# EAGLE design main (EAGLE 7.2.0)
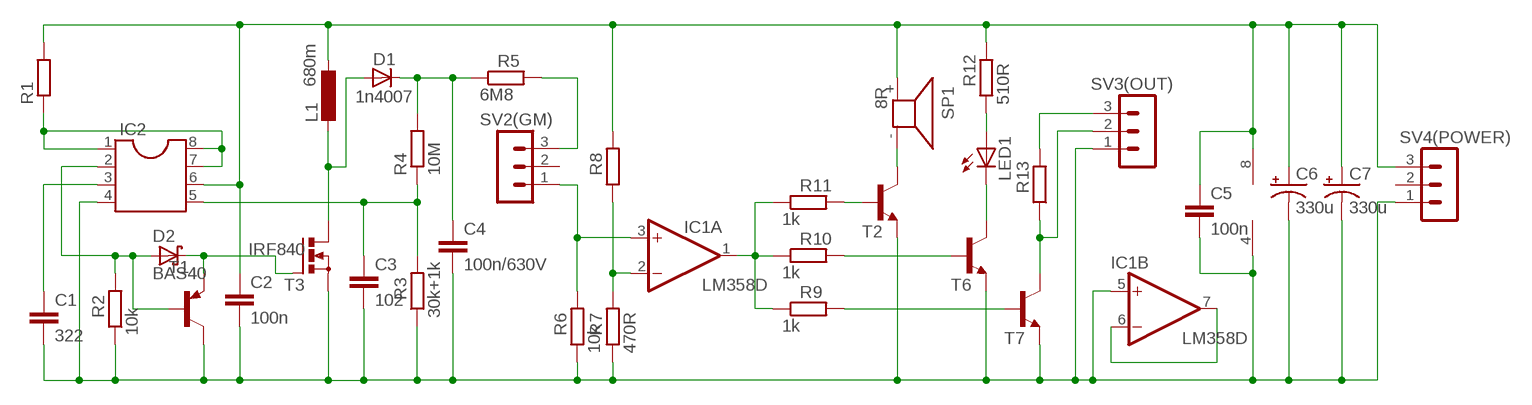
[diagram p0: schematic, sheet 1]

## Parts
C1  322  C-EU050-025X075  [C050-025X075]
C2  100n  C-EUC3216  [C3216]
C3  102  C-EU050-025X075  [C050-025X075]
C4  100n/630V  C-EU102-064X133  [C102-064X133]
C5  100n  C-EUC3216  [C3216]
C6  330u  CPOL-USA/3216-18W  [A/3216-18W]
C7  330u  CPOL-USA/3216-18W  [A/3216-18W]
D1  1n4007  1N4004  [DO41-10]
D2  BAS40  [SOT23]
IC1  LM358D  [SO08]
IC2  DIL8  [DIL08]
L1  680m  L-EU0207/5V  [0207/5V]
LED1  LEDSFH482  [SFH482]
R1  R-EU_0207/5V  [0207/5V]
R2  10k  R-EU_0207/5V  [0207/5V]
R3  30k+1k  R-EU_0207/5V  [0207/5V]
R4  10M  R-EU_0207/5V  [0207/5V]
R5  6M8  R-EU_0207/12  [0207/12]
R6  10k  R-EU_0207/5V  [0207/5V]
R7  470R  R-EU_0207/5V  [0207/5V]
R8  R-EU_0207/5V  [0207/5V]
R9  1k  R-EU_M1206  [M1206]
R10  1k  R-EU_M1206  [M1206]
R11  1k  R-EU_M1206  [M1206]
R12  510R  R-EU_M1206  [M1206]
R13  R-EU_M1206  [M1206]
SP1  8R  KSS1201  [KSS1201]
SV2(GM)  MA03-1  [MA03-1]
SV3(OUT)  MA03-1  [MA03-1]
SV4(POWER)  MA03-1  [MA03-1]
T1  BC807-40-PNP-SOT23-BEC  [SOT23-BEC]
T2  BC848ALT1SMD  [SOT23]
T3  IRF840  BUZ11BV  [TO220BV]
T6  BC848ALT1SMD  [SOT23]
T7  BC848ALT1SMD  [SOT23]

## Nets
N$1: R9.2 T7.1(B)
N$2: R10.2 T6.1(B)
N$3: LED1.K(C) T6.3(C)
N$4: R13.1 SV3(OUT).2 T7.3(C)
N$5: C1.1 IC2.3
N$6: LED1.A R12.1
N$8: IC1.1(A:OUT) R9.1 R10.1 R11.1
N$9: SP1.- T2.3(C)
N$10: R11.2 T2.1(B)
N$11: IC2.1 IC2.7 IC2.8 R1.1
N$12 [hv]: C4.1 D1.C R4.2 R5.1
N$13: C3.1 IC2.5 R3.2 R4.1
N$14: D2.1(A) IC2.2 R2.2 T1.B
N$15 [hv]: D1.A L1.2 T3.D
N$16: D2.3(C) T1.E T3.G
N$17: IC1.3(A:+IN) R6.2 SV2(GM).1
N$19: IC1.2(A:-IN) R7.2 R8.1
N$20 [hv]: R5.2 SV2(GM).3
N$21: R13.2 SV3(OUT).3
N$22: IC1.6(B:-IN) IC1.7(B:OUT)
V+: C2.1 C5.1 C6.+ C7.+ IC1.8(P:V+) IC2.6 L1.1 R1.2 R8.2 R12.2 SP1.+ SV4(POWER).3
V-: C1.2 C2.2 C3.2 C4.2 C5.2 C6.- C7.- IC1.4(P:V-) IC1.5(B:+IN) IC2.4 R2.1 R3.1 R6.1 R7.1 SV3(OUT).1 SV4(POWER).1 T1.C T2.2(E) T3.S T6.2(E) T7.2(E)
Unconnected: SV2(GM).2 SV4(POWER).2

## Library data of the parts
C1-C5 = resistor:C-EU: CAPACITOR, European symbol
C6 C7 = resistor:CPOL-US: POLARIZED CAPACITOR, American symbol
D1 = diode:1N4004: DIODE general purpose rectifier, 1 A
D2 = diode:BAS40: Silicon Schottky Diodes General-purpose diode for high-speed switching
IC1 = linear:LM358: OP AMP also LM158; LM258; LM2904 Source: http://cache.national.com/ds/LM/LM158.pdf
IC2 = ic-package:DIL8: Dual In Line / Socket
L1 = resistor:L-EU: INDUCTOR, European symbol
LED1 = led:LED: LED OSRAM: - CHIPLED LG R971, LG N971, LY N971, LG Q971, LY Q971, LO R971, LY R971 LH N974, LH R974 LS Q976, LO Q976, LY Q976 LO Q996 - Hyper CHIPLED LW Q18S LB Q993, LB Q99A, LB R99A - SideLED LS A670, LO A670, LY A670, LG A670, LP A670 LB A673, LV A673, LT A673, LW A673 LH A674 LY A675 LS A676, LA A676, LO A676, LY A676, LW A676 LS A679, LY A679, LG A679 - Hyper Micro SIDELED® LS Y876, LA Y876, LO Y876, LY Y876 LT Y87S - SmartLED LW L88C, LW L88S LB L89C, LB L89S, LG L890 LS L89K, LO L89K, LY L89K LS L896, LA L896, LO L896, LY L896 - TOPLED LS T670, LO T670, LY T670, LG T670, LP T670 LSG T670, LSP T670, LSY T670, LOP T670, LYG T670 LG T671, LOG T671, LSG T671 LB T673, LV T673, LT T673, LW T673 LH T674 LS T676, LA T676, LO T676, LY T676, LB T676, LH T676, LSB T676, LW T676 LB T67C, LV T67C, LT T67C, LS T67K, LO T67K, LY T67K, LW E67C LS E67B, LA E67B, LO E67B, LY E67B, LB E67C, LV E67C, LT E67C LW T67C LS T679, LY T679, LG T679 LS T770, LO T770, LY T770, LG T770, LP T770 LB T773, LV T773, LT T773, LW T773 LH T774 LS E675, LA E675, LY E675, LS T675 LS T776, LA T776, LO T776, LY T776, LB T776 LHGB T686 LT T68C, LB T68C - Hyper Mini TOPLED® LB M676 - Mini TOPLED Santana® LG M470 LS M47K, LO M47K, LY M47K Source: http://www.osram.convergy.de LUXEON: - LUMILED® LXK2-PW12-R00, LXK2-PW12-S00, LXK2-PW14-U00, LXK2-PW14-V00 LXK2-PM12-R00, LXK2-PM12-S00, LXK2-PM14-U00 LXK2-PE12-Q00, LXK2-PE12-R00, LXK2-PE12-S00, LXK2-PE14-T00, LXK2-PE14-U00 LXK2-PB12-K00, LXK2-PB12-L00, LXK2-PB12-M00, LXK2-PB14-N00, LXK2-PB14-P00, LXK2-PB14-Q00 LXK2-PR12-L00, LXK2-PR12-M00, LXK2-PR14-Q00, LXK2-PR14-R00 LXK2-PD12-Q00, LXK2-PD12-R00, LXK2-PD12-S00 LXK2-PH12-R00, LXK2-PH12-S00 LXK2-PL12-P00, LXK2-PL12-Q00, LXK2-PL12-R00 Source: www.luxeon.com KINGBRIGHT: KA-3528ASYC Source: www.kingbright.com
R1-R13 = resistor:R-EU_: RESISTOR, European symbol
SP1 = buzzer:KSS1201: SPEAKER Source: Schukat; OC_FARNELL: unknown; OC_NEWARK: unknown
SV2(GM) SV3(OUT) SV4(POWER) = con-lstb:MA03-1: PIN HEADER; OC_FARNELL: unknown; OC_NEWARK: unknown
T1 = transistor:*-PNP-: PNP Transistror
T2 T6 T7 = transistor-npn:BC848*: NPN Transistor
T3 = transistor-power:BUZ11: N-CHANNEL MOS FET

## Net classes
1 hv: clearance 0.584 mm

## Board
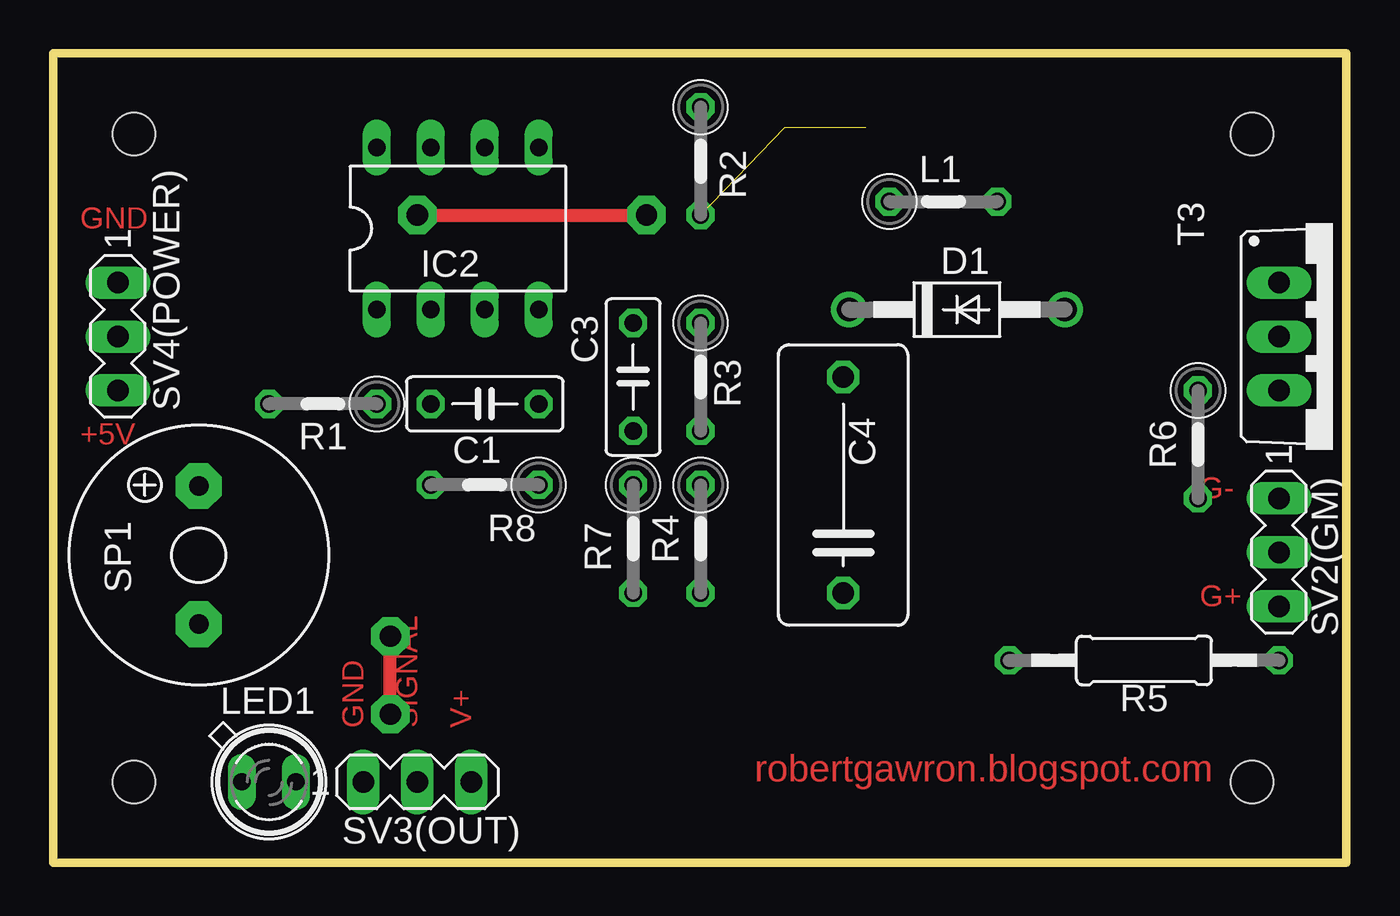
[diagram p1: board, top side]
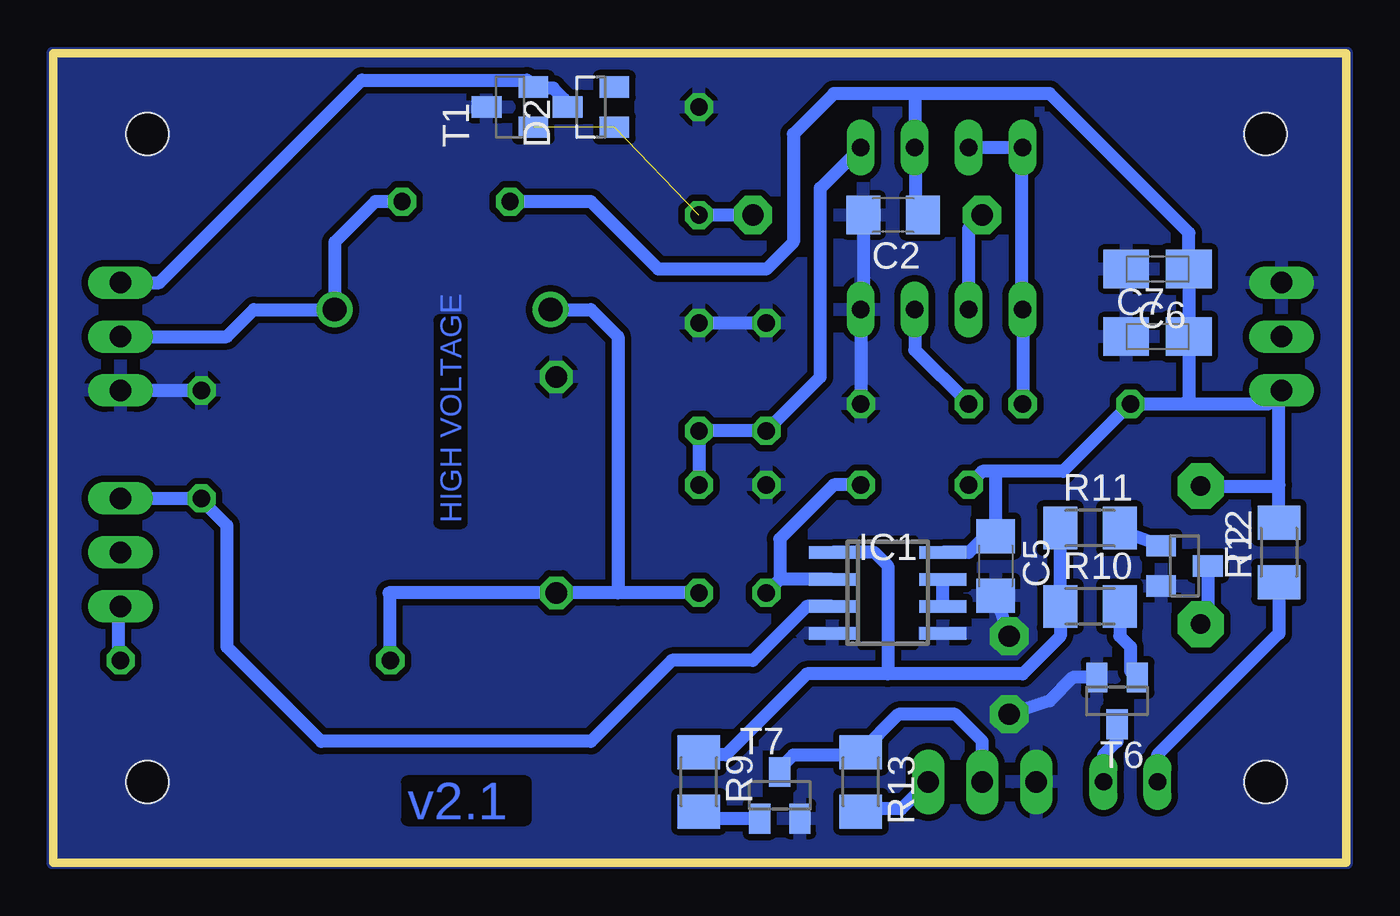
[diagram p2: board, bottom side, seen from below]

Size 60.88 x 38.1 mm. Coordinates in mm from the lower left corner, seen from the top.
Outline: 0,38.1 0,0 60.88,0 60.88,38.1 0,38.1
Copper layers (1*16): Top 0.035mm / dielectric 1.5mm / Bottom 0.035mm
Design rules "default *": minimum track width 10mil, minimum drill 24mil, track to track 12mil, track to pad 12mil, pad to pad 8mil, via to via 8mil, smd to smd 8mil, copper to edge 0mil, drill to drill 8mil, minimum pad ring 10mil, minimum via ring 8mil, stop-mask expansion 4mil, vias tented up to drill 0mil, thermal gap 10mil
Holes 2 mm at 3.81,3.81 3.81,34.29 56.43,34.29 56.43,3.81
bRestrict: area 20.3,10.2 to 22.9,15.2

### Footprints (pad centres in the part's own frame; a part is rotated, then mirrored left to right if it is on the bottom)
C050-025X075 = drill 0.813 octagon: 1 -2.54,0; 2 2.54,0
C3216 = smd 1.6 x 1.8: 1 -1.4,0; 2 1.4,0
C102-064X133 = drill 1.016 octagon: 1 -5.08,0; 2 5.08,0
A/3216-18W = smd 2.15 x 1.8: + 1.475,0; - -1.475,0
DO41-10 = drill 1.118: A 5.08,0; C -5.08,0
SOT23 = smd 1 x 1.4: 1 -0.95,-1.1; 2 0.95,-1.1; 3 0,1.1
SO08 = smd 0.6 x 2.2: 1 -1.905,-2.6; 2 -0.635,-2.6; 3 0.635,-2.6; 4 1.905,-2.6; 5 1.905,2.6; 6 0.635,2.6; 7 -0.635,2.6; 8 -1.905,2.6
DIL08 = drill 0.813 long: 1 -3.81,-3.81; 2 -1.27,-3.81; 3 1.27,-3.81; 4 3.81,-3.81; 5 3.81,3.81; 6 1.27,3.81; 7 -1.27,3.81; 8 -3.81,3.81
0207/5V = drill 0.813 octagon: 1 -2.54,0; 2 2.54,0
SFH482 = drill 0.813 long: A -1.27,0; K 1.27,0
0207/12 = drill 0.813 octagon: 1 -6.35,0; 2 6.35,0
M1206 = smd 1.6 x 2: 1 -1.4,0; 2 1.4,0
KSS1201 = drill 0.914 pad 2.159 octagon: + 3.251,0; - -3.251,0
MA03-1 = drill 1.016 long: 1 -2.54,0; 2 0,0; 3 2.54,0
SOT23-BEC = smd 1 x 1.4: B -0.95,-1.1; C 0,1.1; E 0.95,-1.1
TO220BV = drill 1.016 long: D 0,-2.54; G -2.54,-2.54; S 2.54,-2.54

### Placement (x,y rotation side)
C1  20.32,21.59 0 top
C2  21.34,30.48 180 bottom
C3  27.3,22.86 90 top
C4  37.2,17.78 90 top
C5  16.51,13.97 270 bottom
C6  8.89,27.94 0 bottom
C7  8.89,24.77 0 bottom
D1  42.54,26.04 0 top
D2  35.56,35.56 90 bottom
IC1  21.59,12.7 270 bottom
IC2  19.05,29.84 0 top
L1  41.91,31.11 0 top
LED1  10.16,3.81 0 top
R1  12.7,21.59 180 top
R2  30.48,33.02 270 top
R3  30.48,22.86 270 top
R4  30.48,15.24 270 top
R5  51.35,9.53 0 top
R6  53.9,19.68 270 top
R7  27.3,15.24 270 top
R8  20.32,17.78 180 top
R9  30.48,3.81 270 bottom
R10  12.06,12.06 0 bottom
R11  12.06,15.75 0 bottom
R12  3.17,14.61 90 bottom
R13  22.86,3.81 270 bottom
SP1  6.86,14.48 90 top
SV2(GM)  57.71,14.61 270 top
SV3(OUT)  17.15,3.81 0 top
SV4(POWER)  3.05,24.77 270 top
T1  39.37,35.56 90 bottom
T2  7.62,13.97 270 bottom
T3  60.24,24.77 270 top
T6  10.8,7.62 180 bottom
T7  26.67,3.17 0 bottom

### Tracks (layer width: path | path; a pad name or v marks a point on that pad's centre or on a via)
N$1
  Bottom 0.61: T7.1 30.15,2.08 R9.2
N$2
  Bottom 0.61: R10.2 10.66,10.66 10.16,10.16 10.16,9.04 T6.1
N$3
  Bottom 0.61: T6.3 10.8,5.71 11.43,5.08 LED1.K
N$4
  Bottom 0.61: R13.1 22.73,5.21 | T7.3 26.67,4.45 26.04,5.08 22.99,5.08 R13.1 | SV3(OUT).2 17.15,5.71 18.41,6.99 21.09,6.99 R13.1
N$5
  Bottom 0.61: IC2.3 20.32,24.13 C1.1
N$6
  Bottom 0.61: R12.1 3.17,10.79 8.89,5.08 LED1.A
N$8
  Bottom 0.61: IC1.1 22.23,14.61 21.59,13.97 21.59,8.89 | 29.85,5.08 30.99,5.08 R9.1 30.35,5.08 29.21,5.08 25.4,8.89 21.59,8.89 | 21.59,8.89 15.24,8.89 13.47,10.66 R10.1 R11.1
N$9
  Bottom 0.61: T2.3 6.52,11.56 SP1.-
N$10
  Bottom 0.61: T2.1 10.47,15.55 R11.2
N$11
  Bottom 0.254: 15.27,26.06 IC2.1
  Bottom 0.61: 15.27,26.06 15.27,33.63 IC2.8 IC2.7 | IC2.1 R1.1
N$12
  Bottom 0.61: R4.2 34.29,12.7 | 34.29,12.7 C4.1 45.09,12.7 45.01,12.62 R5.1 | D1.C 35.56,26.04 34.29,24.77 34.29,12.7
N$13
  Bottom 0.61: R4.1 R3.2 C3.1 24.76,22.86 24.76,31.75 IC2.5
N$14  (via drill 1)  (2 unrouted)
  Top 0.61: v17.15,30.48 v27.94,30.48
  Bottom 0.61: IC2.2 17.78,29.84 v17.15,30.48 | v27.94,30.48 R2.2
N$15
  Bottom 0.61: T3.D 52.71,24.77 51.43,26.04 48.26,26.04 | 48.26,26.04 D1.A 47.63,29.21 45.72,31.11 L1.2 | 47.63,26.67 48.26,26.04
N$16
  Bottom 0.61: D2.3 36.83,35.56 36.83,35.94 37.34,36.45 38.21,36.45 T1.E 38.59,36.83 46.35,36.83 55.88,27.3 T3.G
N$17
  Bottom 0.61: SV2(GM).1 R6.2 53.9,17.07 52.71,15.88 52.71,10.16 48.26,5.71 35.56,5.71 31.75,9.53 27.94,9.53 25.4,12.06 IC1.3
N$19
  Bottom 0.61: 26.67,13.34 26.67,15.24 24.13,17.78 R8.1 | 26.67,13.34 R7.2 | IC1.2 26.67,13.34
N$20
  Bottom 0.61: R5.2 57.81,9.63 57.81,11.96 SV2(GM).3
N$21
  Bottom 0.61: SV3(OUT).3 20.96,2.54 22.73,2.54 R13.2
N$22
  Bottom 0.61: IC1.6 IC1.7
V+
  Bottom 0.254: 20.07,30.63 C2.1 | 20.3,33.6 IC2.6
  Bottom 0.61: 20.3,33.6 20.3,30.84 C2.1 | 20.32,36.2 13.97,36.2 7.41,29.64 C6.+ C7.+ 7.41,21.8 7.62,21.59 | 20.32,36.2 IC2.6 | R12.2 3.17,17.78 | 3.17,17.78 3.17,22.1 SV4(POWER).3 3.68,21.59 7.62,21.59 | SP1.+ 3.23,17.73 3.17,17.78 | 7.62,21.59 R1.2 13.34,18.41 16.51,18.41 | C5.1 16.64,15.37 | IC1.8 17.78,14.61 17.02,15.37 16.64,15.37 | 16.51,18.41 17.15,18.41 R8.2 | 16.64,15.37 16.51,15.24 16.51,18.41 | L1.1 35.56,31.11 32.38,27.94 27.3,27.94 26.04,29.21 26.04,34.29 24.13,36.2 20.32,36.2
V-  (via drill 1)
  Top 0.61: v15.88,6.99 v15.88,10.66
  Bottom 0.61: C1.2 IC2.4 22.74,26.16 C2.2 | T3.S R6.1 | C3.2 R3.1 | T6.2 12.87,8.72 13.97,7.62 v15.88,6.99 | v15.88,10.66 C5.2
  pour Bottom: 0,38.1 0,0 60.88,0 60.88,38.1

### Text on the board
Top: GND | +5V | G- | G+ | GND | SIGNAL | V+ | robertgawron.blogspot.com
Bottom: HIGH VOLTAGE | v2.1